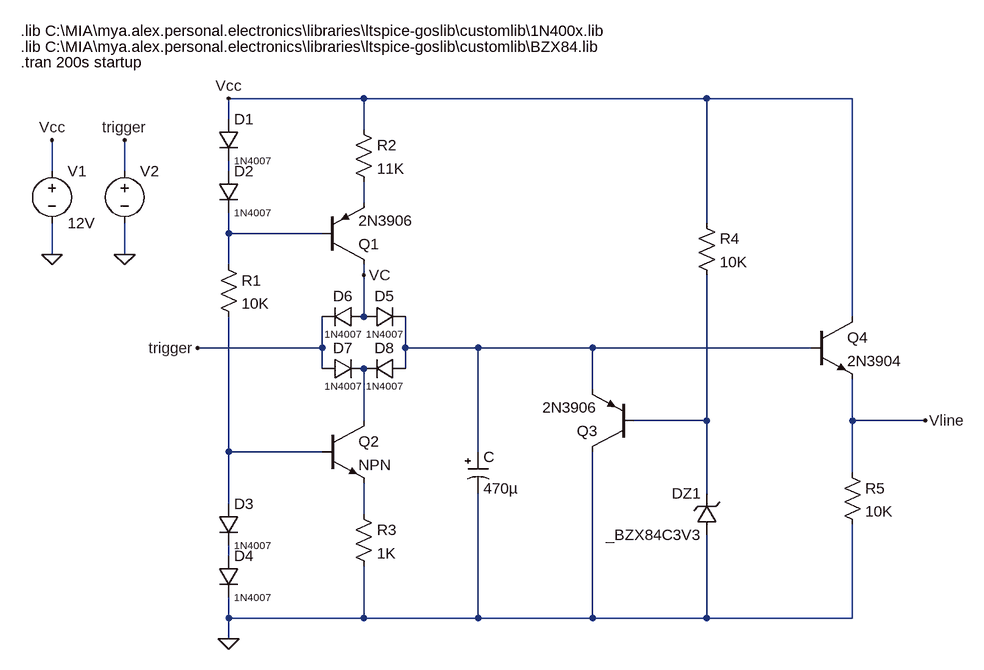
[diagram p0: schematic transitions-generator.asc]
transitions-generator.asc, the LTspice schematic file:
Version 4
SHEET 1 1424 868
WIRE 288 -144 80 -144
WIRE 816 -144 288 -144
WIRE 1040 -144 816 -144
WIRE 80 -112 80 -144
WIRE 288 -96 288 -144
WIRE -192 -32 -192 -80
WIRE -80 -32 -80 -80
WIRE 80 -32 80 -48
WIRE 288 16 288 -16
WIRE 816 48 816 -144
WIRE 80 64 80 32
WIRE 224 64 80 64
WIRE -192 96 -192 48
WIRE -80 96 -80 48
WIRE 80 112 80 64
WIRE 288 128 288 112
WIRE 288 192 288 128
WIRE 1040 192 1040 -144
WIRE 224 240 224 192
WIRE 224 240 32 240
WIRE 352 240 352 192
WIRE 464 240 352 240
WIRE 640 240 464 240
WIRE 976 240 640 240
WIRE 224 272 224 240
WIRE 352 272 352 240
WIRE 640 304 640 240
WIRE 288 352 288 272
WIRE 816 352 816 128
WIRE 816 352 704 352
WIRE 1040 352 1040 288
WIRE 1152 352 1040 352
WIRE 80 400 80 192
WIRE 224 400 80 400
WIRE 464 400 464 240
WIRE 1040 432 1040 352
WIRE 816 464 816 352
WIRE 80 480 80 400
WIRE 288 496 288 448
WIRE 80 560 80 544
WIRE 80 656 80 624
WIRE 288 656 288 576
WIRE 288 656 80 656
WIRE 464 656 464 464
WIRE 464 656 288 656
WIRE 640 656 640 400
WIRE 640 656 464 656
WIRE 816 656 816 528
WIRE 816 656 640 656
WIRE 1040 656 1040 512
WIRE 1040 656 816 656
WIRE 80 688 80 656
FLAG -192 96 0
FLAG -192 -80 Vcc
FLAG 288 128 VC
FLAG 80 -144 Vcc
FLAG 80 688 0
FLAG 32 240 trigger
FLAG -80 96 0
FLAG -80 -80 trigger
FLAG 1152 352 Vline
SYMBOL voltage -192 -48 R0
WINDOW 123 0 0 Left 0
WINDOW 39 0 0 Left 0
SYMATTR InstName V1
SYMATTR Value 12V
SYMBOL pnp 224 112 M180
SYMATTR Value 2N3906
SYMATTR InstName Q1
SYMBOL res 272 -112 R0
SYMATTR InstName R2
SYMATTR Value 11K
SYMBOL res 64 96 R0
SYMATTR InstName R1
SYMATTR Value 10K
SYMBOL diode 64 -32 R0
WINDOW 3 24 64 Left 1
SYMATTR Value 1N4007
SYMATTR InstName D2
SYMBOL diode 64 -112 R0
WINDOW 3 24 64 Left 1
SYMATTR Value 1N4007
SYMATTR InstName D1
SYMBOL npn 224 352 R0
SYMATTR InstName Q2
SYMBOL polcap 448 400 R0
WINDOW 3 24 56 Left 2
SYMATTR Value 470µ
SYMATTR InstName C
SYMATTR Description Capacitor
SYMATTR Type cap
SYMBOL res 272 480 R0
SYMATTR InstName R3
SYMATTR Value 1K
SYMBOL diode 64 480 R0
WINDOW 3 24 64 Left 1
SYMATTR Value 1N4007
SYMATTR InstName D3
SYMBOL diode 64 560 R0
WINDOW 3 24 64 Left 1
SYMATTR Value 1N4007
SYMATTR InstName D4
SYMBOL pnp 704 400 R180
SYMATTR Value 2N3906
SYMATTR InstName Q3
SYMBOL diode 288 208 R270
WINDOW 3 0 32 VBottom 1
WINDOW 0 32 32 VTop 2
SYMATTR Value 1N4007
SYMATTR InstName D5
SYMBOL diode 288 176 R90
WINDOW 3 32 32 VTop 1
WINDOW 0 0 32 VBottom 2
SYMATTR Value 1N4007
SYMATTR InstName D6
SYMBOL diode 224 288 R270
WINDOW 3 0 32 VBottom 1
WINDOW 0 32 32 VTop 2
SYMATTR Value 1N4007
SYMATTR InstName D7
SYMBOL diode 352 256 R90
WINDOW 3 32 32 VTop 1
WINDOW 0 0 32 VBottom 2
SYMATTR Value 1N4007
SYMATTR InstName D8
SYMBOL zener 832 528 R180
WINDOW 0 24 64 Left 2
WINDOW 3 24 0 Left 2
SYMATTR InstName DZ1
SYMATTR Value _BZX84C3V3
SYMBOL res 800 32 R0
SYMATTR InstName R4
SYMATTR Value 10K
SYMBOL voltage -80 -48 R0
WINDOW 123 0 0 Left 0
WINDOW 39 0 0 Left 0
WINDOW 3 24 96 Invisible 2
SYMATTR Value PULSE(0 8.5V 10s 1us 1us 50s 80s)
SYMATTR InstName V2
SYMBOL npn 976 192 R0
SYMATTR InstName Q4
SYMATTR Value 2N3904
SYMBOL res 1024 416 R0
SYMATTR InstName R5
SYMATTR Value 10K
TEXT -240 -200 Left 2 !.tran 200s startup
TEXT -240 -224 Left 2 !.lib C:\\MIA\\mya.alex.personal.electronics\\libraries\\ltspice-goslib\\customlib\\BZX84.lib
TEXT -240 -248 Left 2 !.lib C:\\MIA\\mya.alex.personal.electronics\\libraries\\ltspice-goslib\\customlib\\1N400x.lib

The netlist it stands for:
* transitions-generator.asc
V1 Vcc 0 12V
Q1 VC N003 N002 0 2N3906
R2 Vcc N002 11K
R1 N003 N007 10K
D2 N001 N003 1N4007
D1 Vcc N001 1N4007
Q2 N005 N007 N008 0 NPN
C N004 0 470µ
R3 N008 0 1K
D3 N007 N009 1N4007
D4 N009 0 1N4007
Q3 0 N006 N004 0 2N3906
D5 VC N004 1N4007
D6 VC trigger 1N4007
D7 trigger N005 1N4007
D8 N004 N005 1N4007
DZ1 0 N006 _BZX84C3V3
R4 Vcc N006 10K
V2 trigger 0 PULSE(0 8.5V 10s 1us 1us 50s 80s)
Q4 Vcc N004 Vline 0 2N3904
R5 Vline 0 10K
.model D D
.lib standard.dio
.model NPN NPN
.model PNP PNP
.lib standard.bjt
.tran 200s startup
.lib C:\MIA\mya.alex.personal.electronics\libraries\ltspice-goslib\customlib\BZX84.lib
.lib C:\MIA\mya.alex.personal.electronics\libraries\ltspice-goslib\customlib\1N400x.lib
.backanno
.end